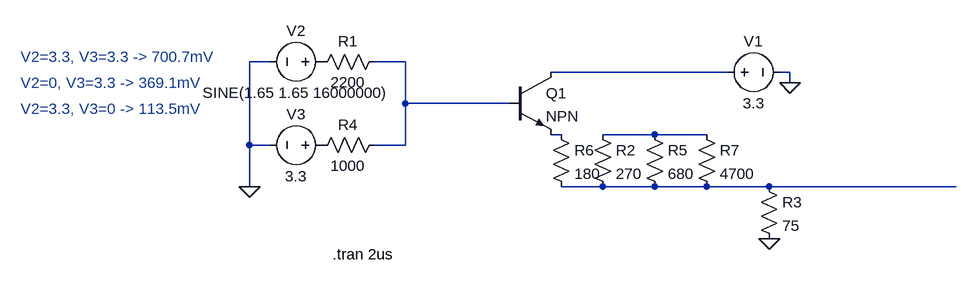
[diagram p0: schematic trans_conv2bit-700mV-180ohm.asc]
trans_conv2bit-700mV-180ohm.asc, the LTspice schematic file:
Version 4
SHEET 1 880 680
WIRE -288 96 -320 96
WIRE -80 96 -128 96
WIRE 416 112 144 112
WIRE 512 112 496 112
WIRE 512 128 512 112
WIRE -80 160 -80 96
WIRE 80 160 -80 160
WIRE 160 208 144 208
WIRE 304 208 224 208
WIRE 384 208 304 208
WIRE -320 224 -320 96
WIRE -288 224 -320 224
WIRE -80 224 -80 160
WIRE -80 224 -128 224
WIRE -320 288 -320 224
WIRE 224 288 160 288
WIRE 304 288 224 288
WIRE 384 288 304 288
WIRE 480 288 384 288
WIRE 768 288 480 288
FLAG 512 128 0
FLAG 480 368 0
FLAG -320 288 0
SYMBOL voltage 400 112 R270
WINDOW 0 32 56 VTop 2
WINDOW 3 -32 56 VBottom 2
WINDOW 123 0 0 Left 2
WINDOW 39 0 0 Left 2
SYMATTR InstName V1
SYMATTR Value 3.3
SYMBOL npn 80 112 R0
SYMATTR InstName Q1
SYMBOL res 464 272 R0
SYMATTR InstName R3
SYMATTR Value 75
SYMBOL res 208 192 R0
SYMATTR InstName R2
SYMATTR Value 270
SYMBOL voltage -192 96 R90
WINDOW 0 -32 56 VBottom 2
WINDOW 3 32 56 VTop 2
WINDOW 123 0 0 Left 2
WINDOW 39 0 0 Left 2
SYMATTR InstName V2
SYMATTR Value SINE(1.65 1.65 16000000)
SYMBOL voltage -192 224 R90
WINDOW 0 -32 56 VBottom 2
WINDOW 3 32 56 VTop 2
WINDOW 123 0 0 Left 2
WINDOW 39 0 0 Left 2
SYMATTR InstName V3
SYMATTR Value 3.3
SYMBOL res -112 80 R90
WINDOW 0 0 56 VBottom 2
WINDOW 3 32 56 VTop 2
SYMATTR InstName R1
SYMATTR Value 2200
SYMBOL res -112 208 R90
WINDOW 0 0 56 VBottom 2
WINDOW 3 32 56 VTop 2
SYMATTR InstName R4
SYMATTR Value 1000
SYMBOL res 288 192 R0
SYMATTR InstName R5
SYMATTR Value 680
SYMBOL res 368 192 R0
SYMATTR InstName R7
SYMATTR Value 4700
SYMBOL res 144 192 R0
SYMATTR InstName R6
SYMATTR Value 180
TEXT -192 392 Left 2 !.tran 2us
TEXT -672 88 Left 2 ;V2=3.3, V3=3.3 -> 700.7mV
TEXT -672 128 Left 2 ;V2=0, V3=3.3 -> 369.1mV
TEXT -672 168 Left 2 ;V2=3.3, V3=0 -> 113.5mV

The netlist it stands for:
* trans_conv2bit-700mV-180ohm.asc
V1 N002 0 3.3
Q1 N002 N001 N003 0 NPN
R3 N005 0 75
R2 N004 N005 270
V2 P001 0 SINE(1.65 1.65 16000000)
V3 P002 0 3.3
R1 N001 P001 2200
R4 N001 P002 1000
R5 N004 N005 680
R7 N004 N005 4700
R6 N003 N005 180
.model NPN NPN
.model PNP PNP
.lib standard.bjt
.tran 2us
* V2=3.3, V3=3.3 -> 700.7mV
* V2=0, V3=3.3 -> 369.1mV
* V2=3.3, V3=0 -> 113.5mV
.backanno
.end